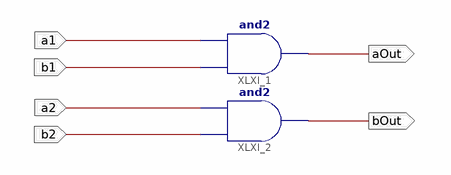
[diagram p0: schematic sheet 1]
// Xilinx ISE schematic doubleAnd.sch (spartan6) as structural Verilog: 2 symbols, 6 ports
module doubleAnd (
  input  a1,
  input  a2,
  input  b1,
  input  b2,
  output aOut,
  output bOut
);

  and XLXI_1 (aOut, b1, a1);
  and XLXI_2 (bOut, b2, a2);
endmodule
